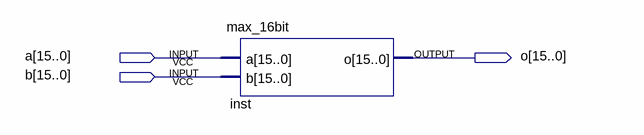
[diagram p0: schematic sheet]
// Quartus schematic Data_pipeline.bdf as structural Verilog: 1 symbols, 3 pins
module Data_pipeline (
  input  [15:0] a,
  input  [15:0] b,
  output [15:0] o
);

  max_16bit inst (.a(a), .b(b), .o(o));
endmodule
